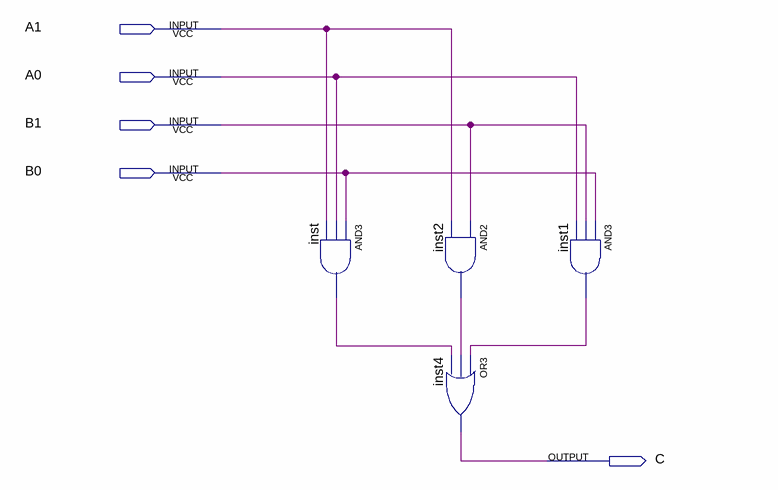
[diagram p0: schematic sheet]
// Quartus schematic LAB03_BlockC.bdf as structural Verilog: 4 symbols, 5 pins
module LAB03_BlockC (
  input  A1,
  input  A0,
  input  B1,
  input  B0,
  output C
);

  wire inst1_out, inst2_out, inst_out;

  and inst (inst_out, B0, A0, A1);
  and inst2 (inst2_out, B1, A1);
  or inst4 (C, inst1_out, inst2_out, inst_out);
  and inst1 (inst1_out, B0, B1, A0);
endmodule
